# EAGLE schematic 3DPrinter-mainboard (EAGLE 6.3)
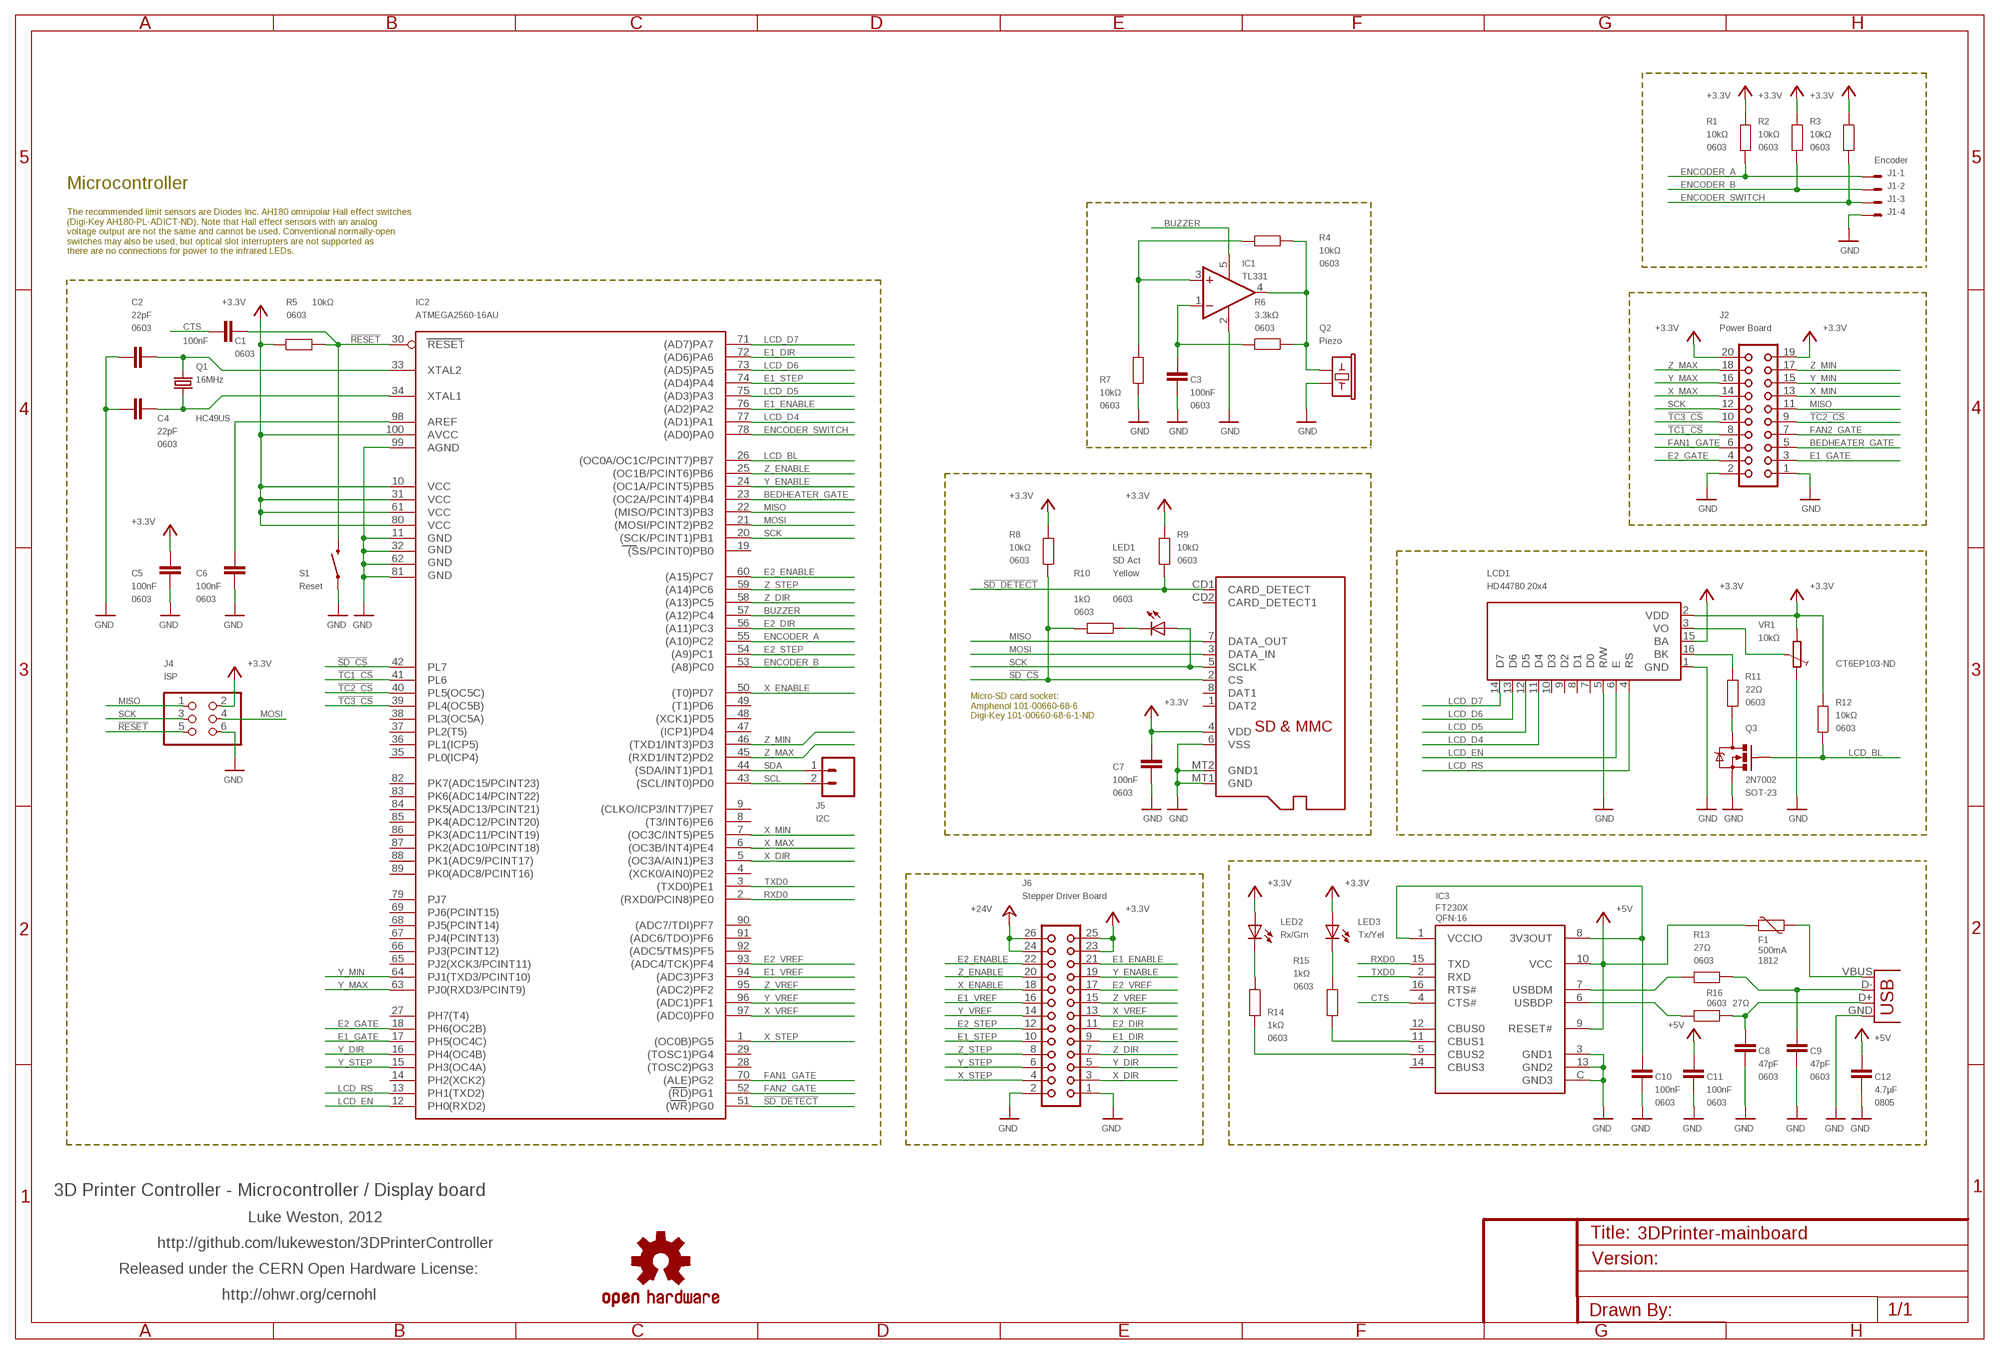
[diagram p0: schematic, sheet 1]

## Parts
C1  100nF  CAP0603  [0603]
C2  22pF  CAP0603  [0603]
C3  100nF  CAP0603  [0603]
C4  22pF  CAP0603  [0603]
C5  100nF  CAP0603  [0603]
C6  100nF  CAP0603  [0603]
C7  100nF  CAP0603  [0603]
C8  47pF  CAP0603  [0603]
C9  47pF  CAP0603  [0603]
C10  100nF  CAP0603  [0603]
C11  100nF  CAP0603  [0603]
C12  4.7µF  CAP0805  [0805]
F1  500mA  PTC  [1812]
IC1  TL331  [DBV-R-PDSO-G5]
IC2  ATMEGA2560-16AU  ATMEGA1280-16AU  [TQFP100]
IC3  FT230X  FT230XQ  [QFN4X4-16]
J1  Encoder  22-05-7048-04  [7395-04]
J2  Power Board  CON20L  [CON20L]
J3  MicroSD Card  ADAFRUIT_MICROSD  [ADAFRUIT_MICROSD]
J4  ISP  PINHD-2X3  [2X03]
J5  I2C  M02PTH  [1X02]
J6  Stepper Driver Board  CON26L  [CON26L]
LCD1  HD44780 20x4  HDM20416L  [HDM20416L]
LED1  SD Act  LED0603  [LED-0603]
LED2  Rx/Grn  LED0603  [LED-0603]
LED3  Tx/Yel  LED0603  [LED-0603]
Q1  16MHz  CRYSTALHC49US  [HC49US]
Q2  Piezo  FREETRONICS-MASTER-V1_BUZZERSMD12X12  [FREETRONICS-MASTER-V1_BUZZER-12X12-SMT]
Q3  2N7002  MOSFET-NCHANNELSMD  [SOT23-3]
R1  10kΩ  RESISTOR0603  [0603]
R2  10kΩ  RESISTOR0603  [0603]
R3  10kΩ  RESISTOR0603  [0603]
R4  10kΩ  RESISTOR0603  [0603]
R5  10kΩ  RESISTOR0603  [0603]
R6  3.3kΩ  RESISTOR0603  [0603]
R7  10kΩ  RESISTOR0603  [0603]
R8  10kΩ  RESISTOR0603  [0603]
R9  10kΩ  RESISTOR0603  [0603]
R10  1kΩ  RESISTOR0603  [0603]
R11  22Ω  RESISTOR0603  [0603]
R12  10kΩ  RESISTOR0603  [0603]
R13  27Ω  RESISTOR0603  [0603]
R14  1kΩ  RESISTOR0603  [0603]
R15  1kΩ  RESISTOR0603  [0603]
R16  27Ω  RESISTOR0603  [0603]
S1  Reset  SWITCH-MOMENTARY-2SMD  [TACTILE_SWITCH_SMD]
SY  OSHW-LOGOS  [OSHW-LOGO-S]
VR1  10kΩ  TRIM_EU-CT6  [CT6]
X1  USB-MICROB  [USB-MICROB]

## Nets
!RESET: C1.2 IC2.30(RESET) J4.5 R5.2 S1.3
!SD_CS: IC2.42(PL7) J3.2(CS) R8.2 R10.2
!SD_DETECT: IC2.51((WR)PG0) J3.CD1(CARD_DETECT) R9.2
!TC1_CS: IC2.41(PL6) J2.8
!TC2_CS: IC2.40(PL5(OC5C)) J2.9
!TC3_CS: IC2.39(PL4(OC5B)) J2.10
+3V3: C5.1 C7.1 IC2.10(VCC) IC2.31(VCC1) IC2.61(VCC2) IC2.80(VCC3) IC2.100(AVCC) J2.19 J2.20 J3.4(VDD) J4.2 J6.23 J6.25 LCD1.2(VDD) LCD1.15(BA) LED2.A LED3.A R1.1 R2.1 R3.1 R5.1 R8.1 R9.1 R12.1 VR1.A ; supply symbol labelled +3.3V
+5V: C11.1 C12.1 F1.2 IC3.9(RESET#) IC3.10(VCC)
+24V: J6.24 J6.26
BEDHEATER_GATE: IC2.23((OC2A/PCINT4)PB4) J2.5
BUZZER: IC1.5(V+) IC2.57((A12)PC4)
CTS: C1.1 IC3.4(CTS#)
E1_DIR: IC2.72((AD6)PA6) J6.9
E1_ENABLE: IC2.76((AD2)PA2) J6.21
E1_GATE: IC2.17(PH5(OC4C)) J2.3
E1_STEP: IC2.74((AD4)PA4) J6.10
E1_VREF: IC2.94((ADC3)PF3) J6.16
E2_DIR: IC2.56((A11)PC3) J6.11
E2_ENABLE: IC2.60((A15)PC7) J6.22
E2_GATE: IC2.18(PH6(OC2B)) J2.4
E2_STEP: IC2.54((A9)PC1) J6.12
E2_VREF: IC2.93((ADC4/TCK)PF4) J6.17
ENCODER_A: IC2.55((A10)PC2) J1.1 R1.2
ENCODER_B: IC2.53((A8)PC0) J1.2 R2.2
ENCODER_SWITCH: IC2.78((AD0)PA0) J1.3 R3.2
FAN1_GATE: IC2.70((ALE)PG2) J2.6
FAN2_GATE: IC2.52((RD)PG1) J2.7
GND: C2.1 C3.2 C4.1 C5.2 C6.2 C7.2 C8.2 C9.2 C10.2 C11.2 C12.2 IC1.2(GND) IC2.11(GND) IC2.32(GND1) IC2.62(GND2) IC2.81(GND3) IC2.99(AGND) IC3.3(GND1) IC3.13(GND2) IC3.C(GND3) J1.4 J2.1 J2.2 J3.6(VSS) J3.MT1(GND) J3.MT2(GND1) J4.6 J6.1 J6.2 LCD1.1(GND) LCD1.5(R/W) Q2.1 Q3.2(S) R7.1 S1.1 VR1.E X1.GND
LCD_BL: IC2.26((OC0A/OC1C/PCINT7)PB7) Q3.1(G) R12.2
LCD_D4: IC2.77((AD1)PA1) LCD1.11(D4)
LCD_D5: IC2.75((AD3)PA3) LCD1.12(D5)
LCD_D6: IC2.73((AD5)PA5) LCD1.13(D6)
LCD_D7: IC2.71((AD7)PA7) LCD1.14(D7)
LCD_EN: IC2.12(PH0(RXD2)) LCD1.6(E)
LCD_RS: IC2.13(PH1(TXD2)) LCD1.4(RS)
MISO: IC2.22((MISO/PCINT3)PB3) J2.11 J3.7(DATA_OUT) J4.1
MOSI: IC2.21((MOSI/PCINT2)PB2) J3.3(DATA_IN) J4.4
N$1: LCD1.16(BK) R11.1
N$2: LED3.C R15.1
N$3: Q3.3(D) R11.2
N$4: IC3.7(USBDM) R13.1
N$8: C2.2 IC2.33(XTAL2) Q1.2
N$10: IC3.11(CBUS1) R15.2
N$11: LED2.C R14.1
N$12: IC3.5(CBUS2) R14.2
N$13: LED1.C R10.1
N$30: C3.1 IC1.1(-IN) R6.2
N$31: IC1.3(+IN) R4.2 R7.2
N$34: IC1.4(OUT) Q2.2 R4.1 R6.1
N$36: C4.2 IC2.34(XTAL1) Q1.1
N$37: C10.1 IC3.1(VCCIO) IC3.8(3V3OUT)
N$38: C6.1 IC2.98(AREF)
N$39: IC3.6(USBDP) R16.1
N$40: C8.1 R16.2 X1.D+
N$41: C9.1 R13.2 X1.D-
N$52: F1.1 X1.VBUS
N$58: LCD1.3(VO) VR1.S
RXD0: IC2.2((RXD0/PCIN8)PE0) IC3.15(TXD)
SCK: IC2.20((SCK/PCINT1)PB1) J2.12 J3.5(SCLK) J4.3 LED1.A
SCL: IC2.43((SCL/INT0)PD0) J5.2
SDA: IC2.44((SDA/INT1)PD1) J5.1
TXD0: IC2.3((TXD0)PE1) IC3.2(RXD)
X_DIR: IC2.5((OC3A/AIN1)PE3) J6.3
X_ENABLE: IC2.50((T0)PD7) J6.18
X_MAX: IC2.6((OC3B/INT4)PE4) J2.14
X_MIN: IC2.7((OC3C/INT5)PE5) J2.13
X_STEP: IC2.1((OC0B)PG5) J6.4
X_VREF: IC2.97((ADC0)PF0) J6.13
Y_DIR: IC2.16(PH4(OC4B)) J6.5
Y_ENABLE: IC2.24((OC1A/PCINT5)PB5) J6.19
Y_MAX: IC2.63(PJ0(RXD3/PCINT9)) J2.16
Y_MIN: IC2.64(PJ1(TXD3/PCINT10)) J2.15
Y_STEP: IC2.15(PH3(OC4A)) J6.6
Y_VREF: IC2.96((ADC1)PF1) J6.14
Z_DIR: IC2.58((A13)PC5) J6.7
Z_ENABLE: IC2.25((OC1B/PCINT6)PB6) J6.20
Z_MAX: IC2.45((RXD1/INT2)PD2) J2.18
Z_MIN: IC2.46((TXD1/INT3)PD3) J2.17
Z_STEP: IC2.59((A14)PC6) J6.8
Z_VREF: IC2.95((ADC2)PF2) J6.15
Unconnected: IC2.4((XCK0/AIN0)PE2) IC2.8((T3/INT6)PE6) IC2.9((CLKO/ICP3/INT7)PE7) IC2.14(PH2(XCK2)) IC2.19((SS/PCINT0)PB0) IC2.27(PH7(T4)) IC2.28((TOSC2)PG3) IC2.29((TOSC1)PG4) IC2.35(PL0(ICP4)) IC2.36(PL1(ICP5)) IC2.37(PL2(T5)) IC2.38(PL3(OC5A)) IC2.47((ICP1)PD4) IC2.48((XCK1)PD5) IC2.49((T1)PD6) IC2.65(PJ2(XCK3/PCINT11)) IC2.66(PJ3(PCINT12)) IC2.67(PJ4(PCINT13)) IC2.68(PJ5(PCINT14)) IC2.69(PJ6(PCINT15)) IC2.79(PJ7) IC2.82(PK7(ADC15/PCINT23)) IC2.83(PK6(ADC14/PCINT22)) IC2.84(PK5(ADC13/PCINT21)) IC2.85(PK4(ADC12/PCINT20)) IC2.86(PK3(ADC11/PCINT19)) IC2.87(PK2(ADC10/PCINT18)) IC2.88(PK1(ADC9/PCINT17)) IC2.89(PK0(ADC8/PCINT16)) IC2.90((ADC7/TDI)PF7) IC2.91((ADC6/TDO)PF6) IC2.92((ADC5/TMS)PF5) IC3.12(CBUS0) IC3.14(CBUS3) IC3.16(RTS#) J3.1(DAT2) J3.8(DAT1) J3.CD2(CARD_DETECT1) LCD1.7(D0) LCD1.8(D1) LCD1.9(D2) LCD1.10(D3)

## Notes on the sheet
- Microcontroller
- The recommended limit sensors are Diodes Inc. AH180 omnipolar Hall effect switches
  (Digi-Key AH180-PL-ADICT-ND). Note that Hall effect sensors with an analog
  voltage output are not the same and cannot be used. Conventional normally-open
  switches may also be used, but optical slot interrupters are not supported as
  there are no connections for power to the infrared LEDs.
- Micro-SD card socket:
  Amphenol 101-00660-68-6
  Digi-Key 101-00660-68-6-1-ND
- FT230X
- 3D Printer Controller - Microcontroller / Display board
- Luke Weston, 2012
- http://github.com/lukeweston/3DPrinterController
- Released under the CERN Open Hardware License:
- http://ohwr.org/cernohl

## Library data of the parts
C1-C11 = freetronics-master-v1:CAP: Capacitor Standard 0603 ceramic capacitor, and 0.1" leaded capacitor.; PACKAGE: 0603
C12 = freetronics-master-v1:CAP: Capacitor Standard 0603 ceramic capacitor, and 0.1" leaded capacitor.; PACKAGE: 0805
F1 = freetronics-luke:PTC: Polymeric PTC ("Polyfuse"); PACKAGE: 1812
IC1 = linear:TL331: SINGLE DIFFERENTIAL COMPARATOR Source: http://www.ti.com .. tl331.pdf
IC2 = atmel-2005:ATMEGA*: MICROCONTROLLER 64/128/256 Kbytes FLASH 4 Kbytes EEPROM 8 Kbytes SRAM 86 General Purpose I/O pins 12-channels16-bit PWM 4 x Serial USARTs 16-channels 10-bit A/D
IC3 = serial:FT230XQ; PACKAGE: QFN-16
J1 = con-molex:22-?-04: CONNECTOR wire to board 2.54 mm (.1 inch) pitch header; OC_FARNELL: unknown; OC_NEWARK: unknown
J2 = con-harting:CON20L: CONNECTOR; OC_FARNELL: unknown; OC_NEWARK: unknown
J3 = RAMPSdisplay:ADAFRUIT_MICROSD: Micro-SD / Transflash card holder with SPI pinout For the 3M # 2908-05WB-MG and/or 4UCON #19656 push-push type
J4 = freetronics-master-v1:PINHD-2X3: PIN HEADER
J5 = freetronics-master-v1:M02: Header 2 Standard 2-pin 0.1" header. Use with straight break away headers (SKU : PRT-00116), right angle break away headers (PRT-00553), swiss pins (PRT-00743), machine pins (PRT-00117), and female headers (PRT-00115). Molex polarized connector foot print use with SKU : PRT-08233 with associated crimp pins and housings.
J6 = con-harting:CON26L: CONNECTOR; OC_FARNELL: unknown; OC_NEWARK: unknown
LCD1 = abi-lcd:HDM20416L
LED1 = freetronics-master-v1:LED: LEDs Standard schematic elements and footprints for 5mm, 3mm, 1206, and 0603 sized LEDs. 5mm - Spark Fun Electronics SKU : COM-00529 (and others); COLOUR: Yellow; PACKAGE: 0603
LED2 LED3 = freetronics-master-v1:LED: LEDs Standard schematic elements and footprints for 5mm, 3mm, 1206, and 0603 sized LEDs. 5mm - Spark Fun Electronics SKU : COM-00529 (and others)
Q1 = freetronics-master-v1:CRYSTAL: Crystals Various standard crystals. Proven footprints. Spark Fun Electronics SKU : COM-00534; PACKAGE: HC49US
Q2 = RAMPSdisplay:FREETRONICS-MASTER-V1_BUZZER: Buzzer - Piezo Transducer
Q3 = freetronics-master-v1:MOSFET-NCHANNEL; PACKAGE: SOT-23
R1-R16 = freetronics-master-v1:RESISTOR: Resistor Basic schematic elements and footprints for 0603, 1206, and PTH 1/10th watt (small) resistors.; PACKAGE: 0603
S1 = SparkFun:SWITCH-MOMENTARY-2
SY = SparkFun:OSHW-LOGO: Open Source Hardware Logo This logo indicates the piece of hardware it is found on incorporates a OSHW license and/or adheres to the definition of open source hardware found here: http://freedomdefined.org/OSHW
VR1 = pot:TRIM_EU-: POTENTIOMETER; SKU: CT6EP103-ND
X1 = freetronics-master-v1:USB: USB Connectors USB-B-PTH is fully proven SKU : PRT-00139 USB-miniB is fully proven SKU : PRT-00587 USB-A-PCB is untested. USB-A-H is throughly reviewed, but untested. Spark Fun Electronics SKU : PRT-00437 USB-B-SMT is throughly reviewed, but untested. Needs silkscreen touching up. USB-A-S has not been used/tested USB-MB-H has not been used/tested

## Net classes
1 USB: drill 0.406 mm, clearance 0.203 mm to class 0, clearance 0.406 mm
3 usbvcc: width 0.61 mm, drill 0.508 mm, clearance 0.203 mm to class 0, clearance 0.254 mm